# EAGLE design sousvide (EAGLE 9.4.2)
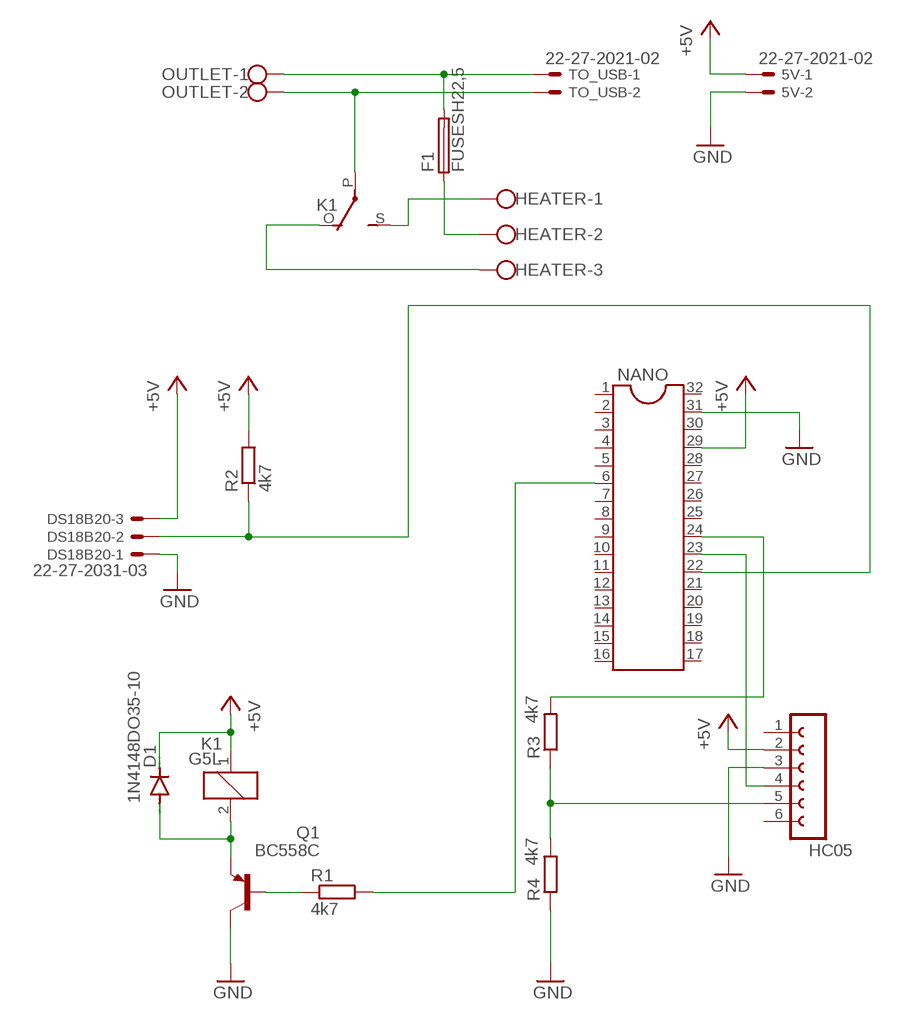
[diagram p0: schematic, sheet 1]

## Parts
5V  22-27-2021-02  [6410-02]
D1  1N4148DO35-10  [DO35-10]
DS18B20  22-27-2031-03  [6410-03]
F1  FUSESH22,5  [SH22,5]
HC05  FE06-1  [FE06]
HEATER  W237-103  [W237-103]
K1  G5L  [G5LE]
NANO  DIL32  [DIL32]
OUTLET  W237-102  [W237-102]
Q1  BC558C  [TO92-EBC]
R1  4k7  R-EU_0204/7  [0204/7]
R2  4k7  R-EU_0204/7  [0204/7]
R3  4k7  R-EU_0204/7  [0204/7]
R4  4k7  R-EU_0204/7  [0204/7]
TO_USB  22-27-2021-02  [6410-02]

## Nets
+5V: 5V.1 D1.C DS18B20.3 HC05.2 K1.1 NANO.29 R2.2
BTRX: HC05.5 R3.1 R4.2
GND: 5V.2 DS18B20.1 HC05.3 NANO.31 Q1.C R4.1
N$1: F1.2 OUTLET.1 TO_USB.1
N$2: K1.P(2:P) OUTLET.2 TO_USB.2
N$6: D1.A K1.2 Q1.E
N$7: Q1.B R1.1
N$8 [power]: F1.1 HEATER.2
NANORX: HC05.4 NANO.23
NANOTX: NANO.24 R3.2
ONEWIRE: DS18B20.2 NANO.22 R2.1
RELAYCONTROL: NANO.6 R1.2
RELAYNA [power]: HEATER.1 K1.S(2:S)
RELAYNC [power]: HEATER.3 K1.O(2:O)
Unconnected: HC05.1 HC05.6 NANO.1 NANO.2 NANO.3 NANO.4 NANO.5 NANO.7 NANO.8 NANO.9 NANO.10 NANO.11 NANO.12 NANO.13 NANO.14 NANO.15 NANO.16 NANO.17 NANO.18 NANO.19 NANO.20 NANO.21 NANO.25 NANO.26 NANO.27 NANO.28 NANO.30 NANO.32

## Library data of the parts
5V TO_USB = con-molex:22-?-02: CONNECTOR wire to board 2.54 mm (.1 inch) pitch header; MF: MOLEX; OC_FARNELL: unknown; OC_NEWARK: unknown
D1 = diode:1N4148: DIODE high speed (Philips)
DS18B20 = con-molex:22-?-03: CONNECTOR wire to board 2.54 mm (.1 inch) pitch header; MF: MOLEX; OC_FARNELL: unknown; OC_NEWARK: unknown
F1 = fuse:FUSE: Fuse; OC_FARNELL: unknown; OC_NEWARK: unknown
HC05 = con-lsta:FE06-1: FEMALE HEADER; OC_FARNELL: unknown; OC_NEWARK: unknown
HEATER = con-wago-500:W237-103: WAGO SCREW CLAMP; MPN: 237-103; OC_FARNELL: unknown; OC_NEWARK: 18M7116
K1 = relay:G5L: RELAY 1 x switch, 10 A/120 V AC, 8 A/30 V ADC, Omron; OC_FARNELL: unknown; OC_NEWARK: unknown
NANO = ic-package:DIL32: Dual In Line
OUTLET = con-wago-500:W237-102: WAGO SCREW CLAMP; MPN: 237-102; OC_FARNELL: unknown; OC_NEWARK: 70K9898
Q1 = transistor-pnp:BC558*: PNP Transistror
R1-R4 = rcl:R-EU_: RESISTOR, European symbol; SPICEPREFIX: R

## Net classes
1 power: width 3.81 mm

## Board
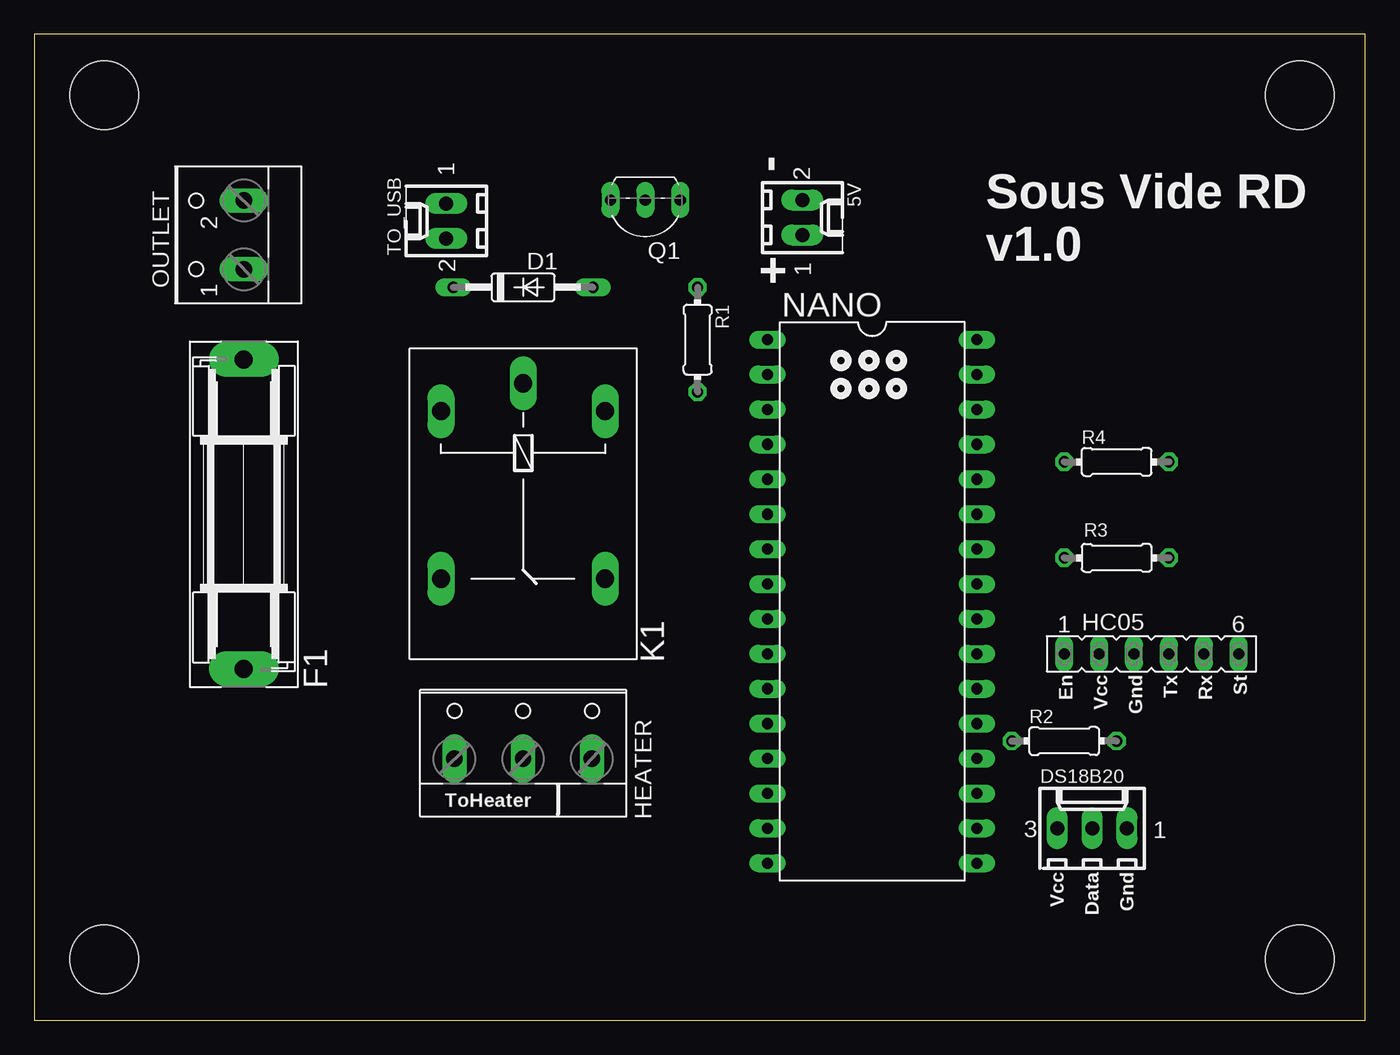
[diagram p1: board, top side]
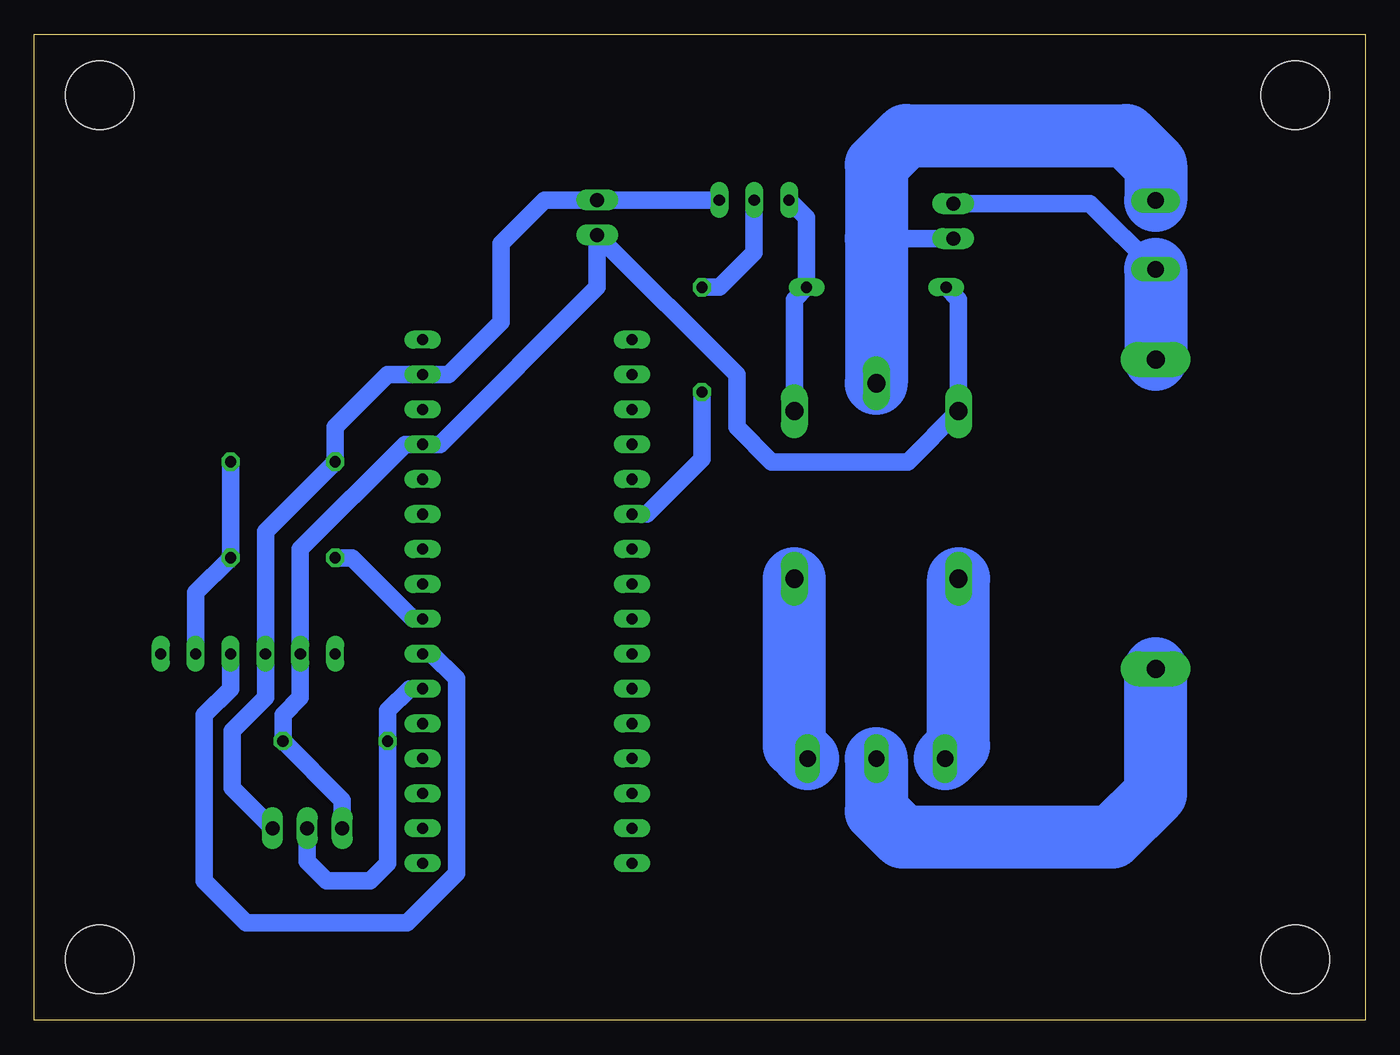
[diagram p2: board, bottom side, seen from below]

Size 96.83 x 71.75 mm. Coordinates in mm from the lower left corner, seen from the top.
Outline: 0,0 96.83,0 96.83,71.75 0,71.75 0,0
Copper layers (1*16): Top 0.035mm / dielectric 1.5mm / Bottom 0.035mm
Design rules "default *": minimum track width 50mil, minimum drill 0.35mm, track to track 16mil, track to pad 20mil, pad to pad 20mil, via to via 20mil, smd to smd 6mil, copper to edge 25mil, drill to drill 6mil, minimum pad ring 10mil, minimum via ring 8mil, stop-mask expansion 4mil, vias tented up to drill 0mil, thermal gap 10mil
Holes 5 mm at 5.08,67.31 92.08,67.31 92.08,4.45 5.08,4.45

### Footprints (pad centres in the part's own frame; a part is rotated, then mirrored left to right if it is on the bottom)
6410-02 = drill 1.016 long: 1 1.27,0; 2 -1.27,0
DO35-10 = drill 0.813 long: A 5.08,0; C -5.08,0
6410-03 = drill 1.016 long: 1 2.54,0; 2 0,0; 3 -2.54,0
SH22,5 = drill 1.321 pad 2.54 long: 1 -11.252,0; 2 11.252,0
FE06 = drill 0.813 long: 1 -6.35,0; 2 -3.81,0; 3 -1.27,0; 4 1.27,0; 5 3.81,0; 6 6.35,0
W237-103 = drill 1.194 long: 1 -5,-1.29; 2 0,-1.29; 3 5,-1.29
G5LE = drill 1.321 long: 1 -7.493,-5.969; 2 -7.493,5.969; O 4.699,5.969; P -9.525,0; S 4.699,-5.969
DIL32 = drill 0.813 long: 1 -19.05,-7.62; 2 -16.51,-7.62; 3 -13.97,-7.62; 4 -11.43,-7.62; 5 -8.89,-7.62; 6 -6.35,-7.62; 7 -3.81,-7.62; 8 -1.27,-7.62; 9 1.27,-7.62; 10 3.81,-7.62; 11 6.35,-7.62; 12 8.89,-7.62; 13 11.43,-7.62; 14 13.97,-7.62; 15 16.51,-7.62; 16 19.05,-7.62; 17 19.05,7.62; 18 16.51,7.62; 19 13.97,7.62; 20 11.43,7.62; 21 8.89,7.62; 22 6.35,7.62; 23 3.81,7.62; 24 1.27,7.62; 25 -1.27,7.62; 26 -3.81,7.62; 27 -6.35,7.62; 28 -8.89,7.62; 29 -11.43,7.62; 30 -13.97,7.62; 31 -16.51,7.62; 32 -19.05,7.62
W237-102 = drill 1.194 long: 1 -2.5,-1.27; 2 2.5,-1.27
TO92-EBC = drill 0.813 long: B 0,-1.27; C -2.54,-1.27; E 2.54,-1.27
0204/7 = drill 0.813 octagon: 1 -3.81,0; 2 3.81,0

### Placement (x,y rotation side)
5V  55.88,58.42 270 top
D1  35.56,53.34 0 top
DS18B20  76.96,13.97 0 top
F1  15.24,36.83 90 top
HC05  81.28,26.67 0 top
HEATER  35.56,20.32 0 top
K1  35.56,36.83 270 top
NANO  60.96,30.48 270 top
OUTLET  13.97,57.15 90 top
Q1  44.45,58.42 180 top
R1  48.26,49.53 270 top
R2  74.93,20.32 0 top
R3  78.74,33.66 180 top
R4  78.74,40.64 0 top
TO_USB  29.97,58.17 90 top

### Tracks (layer width: path | path; a pad name or v marks a point on that pad's centre or on a via)
+5V
  Bottom 1.27: DS18B20.3 74.42,16 R2.2 78.74,22.23 77.47,23.5 HC05.2 77.47,34.29 69.85,41.91 NANO.29 67.31,41.91 55.88,53.34 5V.1 45.72,46.99 45.72,43.18 43.18,40.64 33.27,40.64 K1.1 29.59,52.45 D1.C
BTRX
  Bottom 1.27: R4.2 R3.1 85.09,31.11 HC05.5
GND
  Bottom 1.27: DS18B20.1 82.45,16.92 82.45,21.07 80.01,23.5 HC05.3 80.01,35.56 R4.1 74.93,43.18 71.12,46.99 NANO.31 66.67,46.99 62.87,50.8 62.87,56.52 59.69,59.69 5V.2 Q1.C
N$1
  Bottom 1.27: OUTLET.1 20.03,59.44 TO_USB.1
  Bottom 4.572: OUTLET.1 F1.2
N$2
  Bottom 1.27: TO_USB.2 35.56,56.9
  Bottom 4.572: K1.P 35.56,56.9 35.56,62.23 33.41,64.38 17.39,64.38 15.24,62.23 OUTLET.2
N$6
  Bottom 1.27: K1.2 41.53,52.45 D1.A 40.64,58.42 Q1.E
N$7
  Bottom 1.27: R1.1 46.99,53.34 44.45,55.88 Q1.B
N$8
  Bottom 4.572: F1.1 15.24,16.51 18.41,13.34 33.66,13.34 35.56,15.24 HEATER.2
NANORX
  Bottom 1.27: NANO.23 67.91,26.67 66.12,24.88 66.12,10.68 69.69,7.11 81.41,7.11 84.45,10.16 84.45,22.23 82.55,24.13 HC05.4
NANOTX
  Bottom 1.27: R3.2 73.7,33.66 69.25,29.21 NANO.24
ONEWIRE
  Bottom 1.27: NANO.22 69.53,24.13 71.12,22.54 R2.1 71.12,11.43 72.39,10.16 75.56,10.16 76.96,11.56 DS18B20.2
RELAYCONTROL
  Bottom 1.27: R1.2 48.26,40.83 52.26,36.83 NANO.6
RELAYNA
  Bottom 4.572: HEATER.1 29.59,20 K1.S
RELAYNC
  Bottom 4.572: HEATER.3 41.53,20 K1.O

### Text on the board
tNames: - | Sous Vide RD / v1.0 | + | En | Vcc | Gnd | Tx | Rx | St | ToHeater | Vcc | Data | Gnd
_tNames: Q1 | 5V | TO_USB | D1 | OUTLET | NANO | R1 | DS18B20 | R2 | K1 | F1 | HC05 | R4 | HEATER | R3